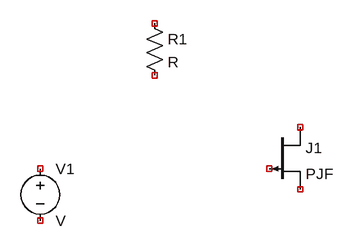
[diagram p0: schematic Draft3.asc]
Draft3.asc, the LTspice schematic file:
Version 4
SHEET 1 880 680
SYMBOL voltage 32 272 R0
SYMATTR InstName V1
SYMBOL res 192 48 R0
SYMATTR InstName R1
SYMBOL pjf 384 224 R0
SYMATTR InstName J1

The netlist it stands for:
* Draft3.asc
V1 NC_01 NC_02 V
R1 NC_03 NC_04 R
J1 NC_05 NC_06 NC_07 PJF
.model NJF NJF
.model PJF PJF
.lib standard.jft
.backanno
.end